# EAGLE design working (EAGLE 9.0.0)
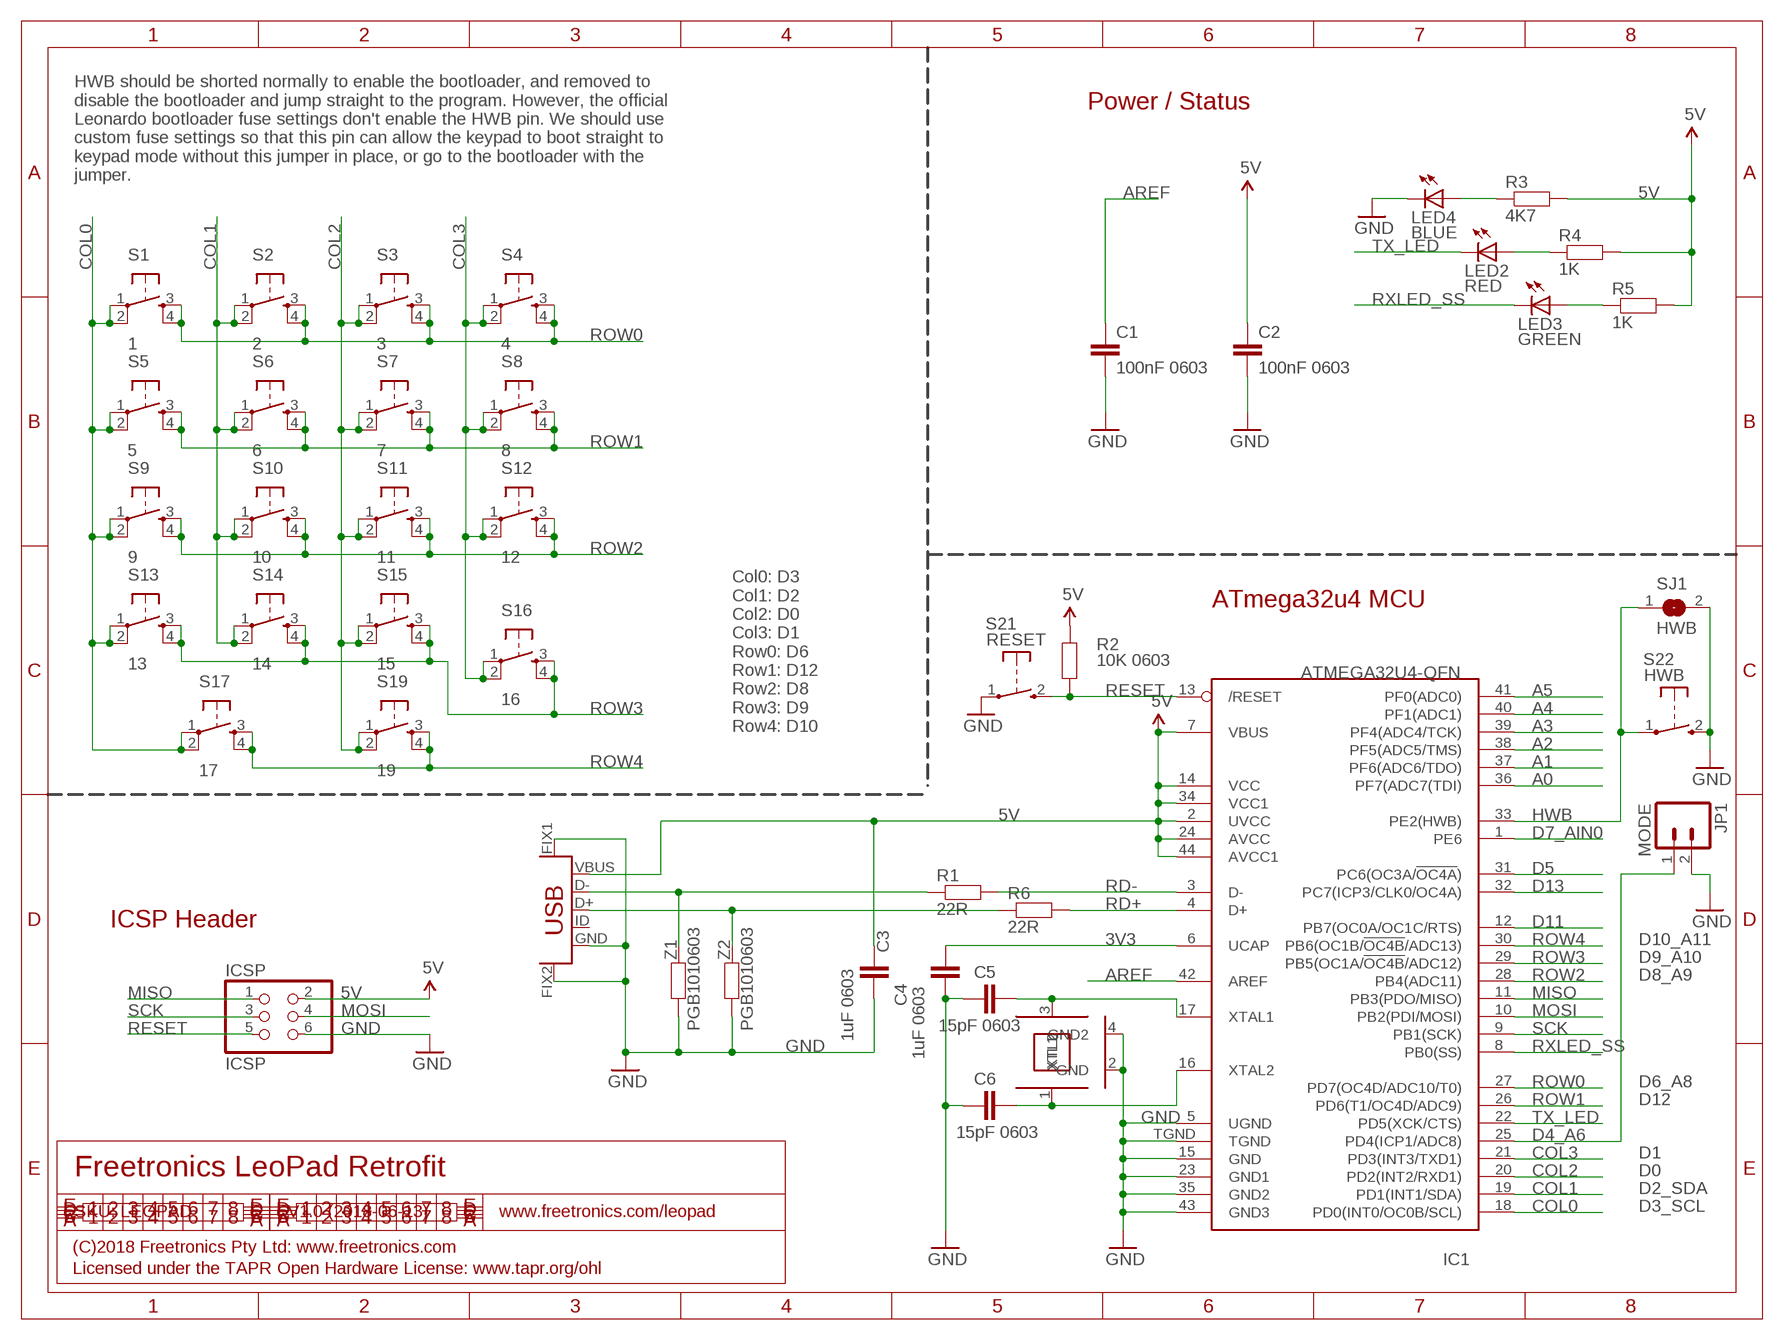
[diagram p0: schematic, sheet 1]

## Parts
C1  100nF 0603  CAP0603  [0603]
C2  100nF 0603  CAP0603  [0603]
C3  1uF 0603  CAP0603  [0603]
C4  1uF 0603  CAP0603  [0603]
C5  15pF 0603  CAP0603  [0603]
C6  15pF 0603  CAP0603  [0603]
IC1  ATMEGA32U4-QFN  [QFN-44N]
ICSP  ICSP  PINHD-2X3  [2X03]
JP1  MODE  M02PTH  [1X02]
LED2  RED  LED0603  [LED-0603]
LED3  GREEN  LED0603  [LED-0603]
LED4  BLUE  LED3MM  [LED3MM]
R1  22R  RESISTOR0603  [0603]
R2  10K 0603  RESISTOR0603  [0603]
R3  4K7  RESISTOR0603  [0603]
R4  1K  RESISTOR0603  [0603]
R5  1K  RESISTOR0603  [0603]
R6  22R  RESISTOR0603  [0603]
S1  1  TAC_SWITCHSMD  [TACTILE_SWITCH_SMD]
S2  2  TAC_SWITCHSMD  [TACTILE_SWITCH_SMD]
S3  3  TAC_SWITCHSMD  [TACTILE_SWITCH_SMD]
S4  4  TAC_SWITCHSMD  [TACTILE_SWITCH_SMD]
S5  5  TAC_SWITCHSMD  [TACTILE_SWITCH_SMD]
S6  6  TAC_SWITCHSMD  [TACTILE_SWITCH_SMD]
S7  7  TAC_SWITCHSMD  [TACTILE_SWITCH_SMD]
S8  8  TAC_SWITCHSMD  [TACTILE_SWITCH_SMD]
S9  9  TAC_SWITCHSMD  [TACTILE_SWITCH_SMD]
S10  10  TAC_SWITCHSMD  [TACTILE_SWITCH_SMD]
S11  11  TAC_SWITCHSMD  [TACTILE_SWITCH_SMD]
S12  12  TAC_SWITCHSMD  [TACTILE_SWITCH_SMD]
S13  13  TAC_SWITCHSMD  [TACTILE_SWITCH_SMD]
S14  14  TAC_SWITCHSMD  [TACTILE_SWITCH_SMD]
S15  15  TAC_SWITCHSMD  [TACTILE_SWITCH_SMD]
S16  16  TAC_SWITCHSMD  [TACTILE_SWITCH_SMD]
S17  17  TAC_SWITCHSMD  [TACTILE_SWITCH_SMD]
S19  19  TAC_SWITCHSMD  [TACTILE_SWITCH_SMD]
S21  RESET  TAC_SWITCH_2PINSMT  [TACTILE_SWITCH_SMD_2PIN_TINY]
S22  HWB  TAC_SWITCH_2PINSMT  [TACTILE_SWITCH_SMD_2PIN_TINY]
SJ1  HWB  SJN  [SJ]
U$2  USB-2P2P  [USB-MICROB-MB05PMXX]
XTL1  16MHz  CRYSTAL-GND3X2  [CRYSTAL-SMD-3X2]
Z1  PGB1010603  RESISTOR0603  [0603]
Z2  PGB1010603  RESISTOR0603  [0603]

## Nets
3V3: C4.2 IC1.6(UCAP)
5V: C2.1 C3.1 IC1.2(UVCC) IC1.7(VBUS) IC1.14(VCC) IC1.24(AVCC) IC1.34(VCC1) IC1.44(AVCC1) ICSP.2 R2.2 R3.2 R4.2 R5.2 U$2.VBUS
A0: IC1.36(PF7(ADC7(TDI))
A1: IC1.37(PF6(ADC6/TDO))
A2: IC1.38(PF5(ADC5/TMS))
A3: IC1.39(PF4(ADC4/TCK))
A4: IC1.40(PF1(ADC1))
A5: IC1.41(PF0(ADC0))
AREF: C1.1 IC1.42(AREF)
COL0: IC1.18(PD0(INT0/OC0B/SCL)) S1.1 S1.2 S5.1 S5.2 S9.1 S9.2 S13.1 S13.2 S17.1 S17.2
COL1: IC1.19(PD1(INT1/SDA)) S2.1 S2.2 S6.1 S6.2 S10.1 S10.2 S14.1 S14.2
COL2: IC1.20(PD2(INT2/RXD1)) S3.1 S3.2 S7.1 S7.2 S11.1 S11.2 S15.1 S15.2 S19.1 S19.2
COL3: IC1.21(PD3(INT3/TXD1)) S4.1 S4.2 S8.1 S8.2 S12.1 S12.2 S16.1 S16.2
D4_A6: IC1.25(PD4(ICP1/ADC8)) JP1.1
D5: IC1.31(PC6(OC3A/!OC4A!))
D7_AIN0: IC1.1(PE6)
D11: IC1.12(PB7(OC0A/OC1C/RTS))
D13: IC1.32(PC7(ICP3/CLK0/OC4A))
D+: R6.1 U$2.D+ Z2.2
D-: R1.1 U$2.D- Z1.2
GND: C1.2 C2.2 C3.2 C4.1 C5.1 C6.1 IC1.5(UGND) IC1.15(GND) IC1.23(GND1) IC1.35(GND2) IC1.43(GND3) IC1.TGND ICSP.6 JP1.2 LED4.K(C) S21.1(P) S22.2(S) SJ1.2 U$2.FIX1(TAB1) U$2.FIX2(TAB2) U$2.GND XTL1.2(GND) XTL1.4(GND2) Z1.1 Z2.1
HWB: IC1.33(PE2(HWB)) S22.1(P) SJ1.1
MISO: IC1.11(PB3(PDO/MISO)) ICSP.1
MOSI: IC1.10(PB2(PDI/MOSI)) ICSP.4
N$6: LED4.A R3.1
N$7: LED2.A R4.1
N$8: LED3.A R5.1
N$11: C5.2 IC1.17(XTAL1) XTL1.3(XTL2)
N$12: C6.2 IC1.16(XTAL2) XTL1.1(XTL1)
RD+: IC1.4(D+) R6.2
RD-: IC1.3(D-) R1.2
RESET: IC1.13(/RESET) ICSP.5 R2.1 S21.2(S)
ROW0: IC1.27(PD7(OC4D/ADC10/T0)) S1.3 S1.4 S2.3 S2.4 S3.3 S3.4 S4.3 S4.4
ROW1: IC1.26(PD6(T1/OC4D/ADC9)) S5.3 S5.4 S6.3 S6.4 S7.3 S7.4 S8.3 S8.4
ROW2: IC1.28(PB4(ADC11)) S9.3 S9.4 S10.3 S10.4 S11.3 S11.4 S12.3 S12.4
ROW3: IC1.29(PB5(OC1A/!OC4B!/ADC12)) S13.3 S13.4 S14.3 S14.4 S15.3 S15.4 S16.3 S16.4
ROW4: IC1.30(PB6(OC1B/!OC4B!/ADC13)) S17.3 S17.4 S19.3 S19.4
RXLED_SS: IC1.8(PB0(SS)) LED3.C
SCK: IC1.9(PB1(SCK)) ICSP.3
TX_LED: IC1.22(PD5(XCK/CTS)) LED2.C
Unconnected: U$2.ID

## Notes on the sheet
- Power / Status
- HWB should be shorted normally to enable the bootloader, and removed to
  disable the bootloader and jump straight to the program. However, the official
  Leonardo bootloader fuse settings don't enable the HWB pin. We should use
  custom fuse settings so that this pin can allow the keypad to boot straight to
  keypad mode without this jumper in place, or go to the bootloader with the
  jumper.
- ATmega32u4 MCU
- Col0: D3
  Col1: D2
  Col2: D0
  Col3: D1
  Row0: D6
  Row1: D12
  Row2: D8
  Row3: D9
  Row4: D10
- ICSP Header
- D10_A11
- D9_A10
- D8_A9
- D6_A8
- D12
- D1
- Freetronics LeoPad Retrofit | D0
- D2_SDA
- D3_SCL
- SKU: LEOPAD | V1.0 (2018-06-13) | www.freetronics.com/leopad
- (C)2018 Freetronics Pty Ltd: www.freetronics.com
- Licensed under the TAPR Open Hardware License: www.tapr.org/ohl

## Library data of the parts
C1-C6 = freetronics-master-v1.1:CAP: Capacitor Standard 0603 ceramic capacitor, and 0.1" leaded capacitor.
IC1 = freetronics-jon:ATMEGA32U4: ATMEGA32U4
ICSP = pinhead:PINHD-2X3: PIN HEADER
JP1 = freetronics-jon:M02: Header 2 Standard 2-pin 0.1" header. Use with straight break away headers (SKU : PRT-00116), right angle break away headers (PRT-00553), swiss pins (PRT-00743), machine pins (PRT-00117), and female headers (PRT-00115). Molex polarized connector foot print use with SKU : PRT-08233 with associated crimp pins and housings.
LED2-LED4 = freetronics-jon:LED: LEDs Standard schematic elements and footprints for 5mm, 3mm, 1206, and 0603 sized LEDs. 5mm - Spark Fun Electronics SKU : COM-00529 (and others)
R1 R3-R6 = freetronics-jon:RESISTOR: Resistor Basic schematic elements and footprints for 0603, 1206, and PTH 1/10th watt (small) resistors.
R2 Z1 Z2 = freetronics-master-v1.1:RESISTOR: Resistor Basic schematic elements and footprints for 0603, 1206, and PTH 1/10th watt (small) resistors.
S1-S17 S19 = freetronics-original:TAC_SWITCH: Momentary Switch Button commonly used for reset or general input. Spark Fun Electronics SKU : COM-00097
S21 S22 = freetronics-jon:TAC_SWITCH_2PIN: Momentary Tactile Switch - 2 pin
SJ1 = freetronics-jon:SJ: SMD solder JUMPER
U$2 = freetronics-jon:USB-2P
XTL1 = freetronics-jon:CRYSTAL-GND

## Net classes
0 default: width 0.152 mm, drill 0.241 mm, clearance 0.152 mm

## Board
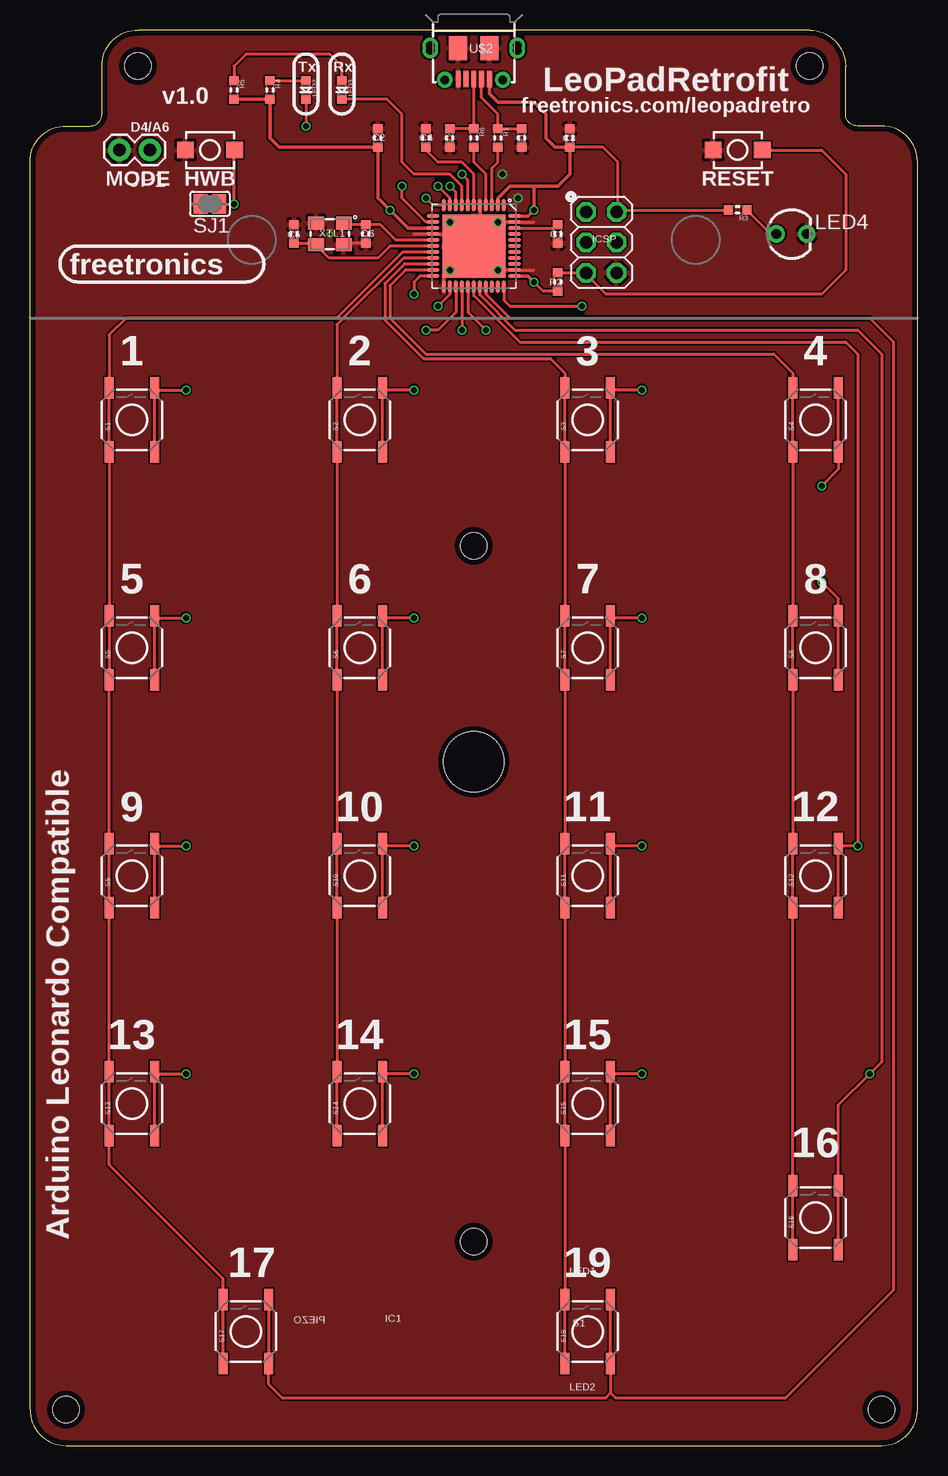
[diagram p1: board, top side]
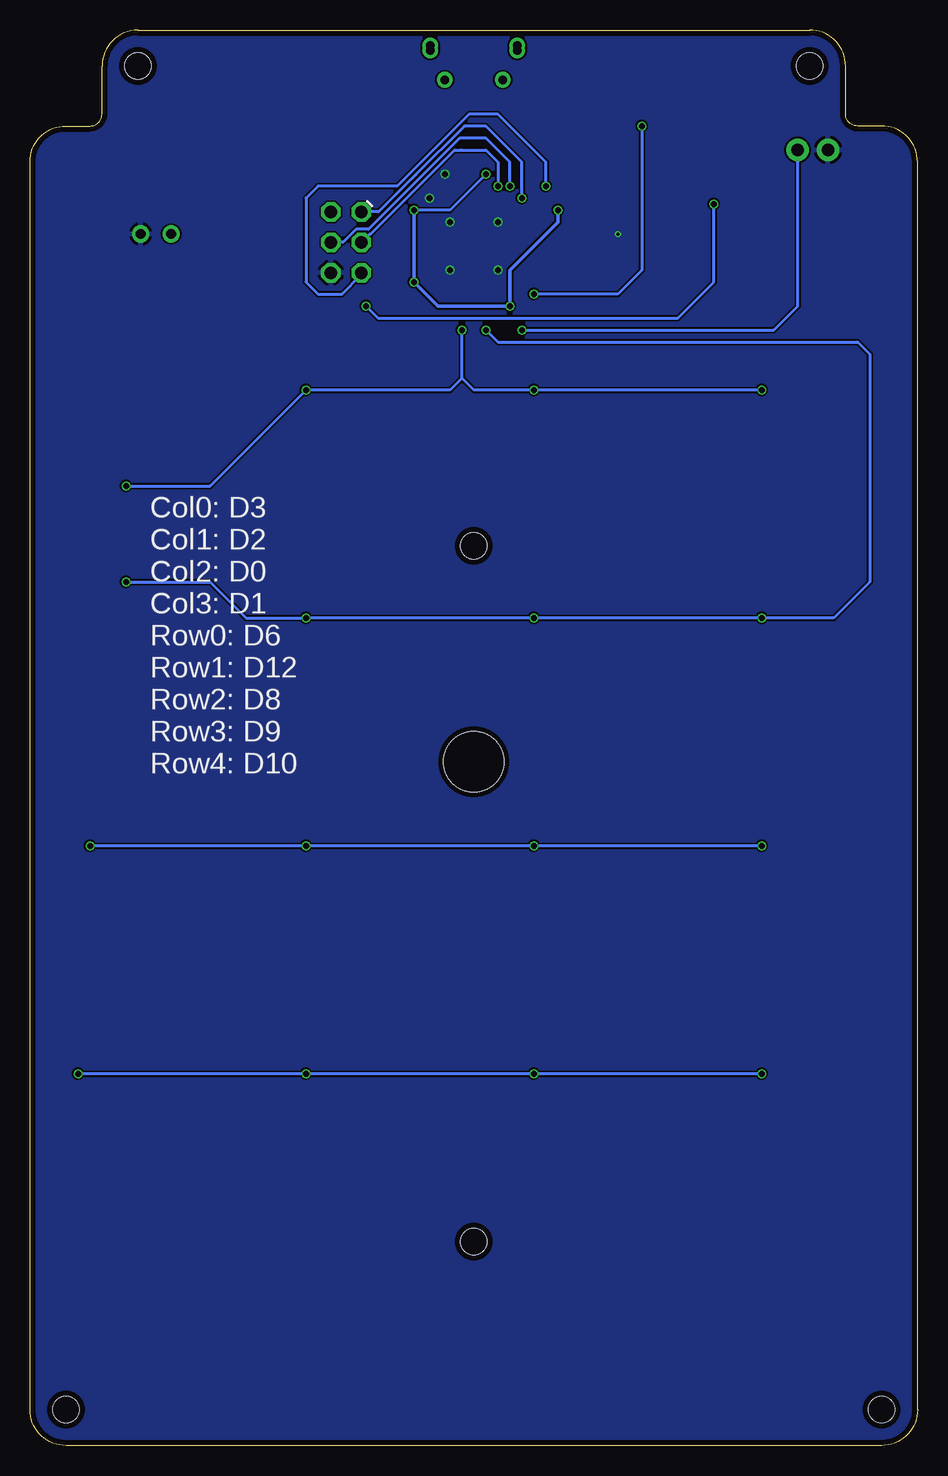
[diagram p2: board, bottom side, seen from below]

Size 74 x 118 mm. Coordinates in mm from the lower left corner, seen from the top.
Outline: 3,0 71,0 arc90 74,3 74,107 arc90 71,110 69,110 arc-90 68,111 68,115 arc90 65,118 9,118 arc90 6,115 6,111 arc-90 5,110 3,110 arc90 0,107 0,3 arc90 3,0
Copper layers (1*16): Top 0.035mm / dielectric 1.5mm / Bottom 0.035mm
Design rules "default *": minimum track width 6mil, minimum drill 9.5mil, track to track 6mil, track to pad 6mil, pad to pad 6mil, via to via 6mil, smd to smd 6mil, copper to edge 18mil, drill to drill 8mil, minimum pad ring 12mil, minimum via ring 4mil, stop-mask expansion 2mil, vias tented up to drill 25mil, thermal gap 10mil
Holes 2.2 mm at 37,75 37,17 9,115 65,115 3,3 71,3
Holes 5 mm at 37,57

### Footprints (pad centres in the part's own frame; a part is rotated, then mirrored left to right if it is on the bottom)
0603 = smd 0.762 x 0.762: 1 -0.762,0; 2 0.762,0
QFN-44N = smd 0.3 x 1.05: 1 -2.5,-3.4; 2 -2,-3.4; 3 -1.5,-3.4; 4 -1,-3.4; 5 -0.5,-3.4; 6 0,-3.4; 7 0.5,-3.4; 8 1,-3.4; 9 1.5,-3.4; 10 2,-3.4; 11 2.5,-3.4; 23 2.5,3.4; 24 2,3.4; 25 1.5,3.4; 26 1,3.4; 27 0.5,3.4; 28 0,3.4; 29 -0.5,3.4; 30 -1,3.4; 31 -1.5,3.4; 32 -2,3.4; 33 -2.5,3.4 | smd 1.05 x 0.3: 12 3.4,-2.5; 13 3.4,-2; 14 3.4,-1.5; 15 3.4,-1; 16 3.4,-0.5; 17 3.4,0; 18 3.4,0.5; 19 3.4,1; 20 3.4,1.5; 21 3.4,2; 22 3.4,2.5; 34 -3.4,2.5; 35 -3.4,2; 36 -3.4,1.5; 37 -3.4,1; 38 -3.4,0.5; 39 -3.4,0; 40 -3.4,-0.5; 41 -3.4,-1; 42 -3.4,-1.5; 43 -3.4,-2; 44 -3.4,-2.5 | smd 5.25 x 5.25: TGND 0,0
2X03 = drill 1.016 octagon: 1 -2.54,-1.27; 2 -2.54,1.27; 3 0,-1.27; 4 0,1.27; 5 2.54,-1.27; 6 2.54,1.27
1X02 = drill 1.016 pad 1.88: 1 0,0; 2 2.54,0
LED-0603 = smd 0.762 x 0.762: A -0.762,0; C 0.762,0
LED3MM = drill 0.813: A -1.27,0; K 1.27,0
TACTILE_SWITCH_SMD = smd 1.778 x 0.762: 1 -2.667,1.905; 2 2.667,1.905; 3 -2.667,-1.905; 4 2.667,-1.905
TACTILE_SWITCH_SMD_2PIN_TINY = smd 1.4 x 1.4: 1 -2.05,0; 2 2.05,0
SJ = smd 1.168 x 1.6: 1 -0.762,0; 2 0.762,0
USB-MICROB-MB05PMXX = smd 0.4 x 1.35: D+ 0,2.575; D- -0.65,2.575; GND 1.3,2.575; ID 0.65,2.575; VBUS -1.3,2.575 | smd 1.5 x 2: FIX1 -1.3,0; FIX2 1.3,0 | drill 0.7: PIN1 -2.425,2.65; PIN2 2.425,2.65; SLOT1 -3.625,-0.2; SLOT2 3.625,-0.2; TAB1 -3.625,0.2; TAB2 3.625,0.2
CRYSTAL-SMD-3X2 = smd 1.3 x 1.1: 1 -1.15,-0.9; 2 1.15,-0.9; 3 1.15,0.9; 4 -1.15,0.9

### Placement (x,y rotation side)
C1  44,101 270 top
C2  29,109 90 top
C3  45,109 90 top
C4  33,109 270 top
C5  22,101 270 top
C6  28,101 90 top
IC1  37,100 180 top
ICSP  47.64,100.3 270 top
JP1  10,108 180 top
LED2  23,113 270 top
LED3  26,113 270 top
LED4  63.5,101 0 top
R1  39,109 270 top
R2  44,97 270 top
R3  59,103 180 top
R4  20,113 270 top
R5  17,113 270 top
R6  37,109 270 top
S1  8.5,85.5 90 top
S2  27.5,85.5 90 top
S3  46.5,85.5 90 top
S4  65.5,85.5 90 top
S5  8.5,66.5 90 top
S6  27.5,66.5 90 top
S7  46.5,66.5 90 top
S8  65.5,66.5 90 top
S9  8.5,47.5 90 top
S10  27.5,47.5 90 top
S11  46.5,47.5 90 top
S12  65.5,47.5 90 top
S13  8.5,28.5 90 top
S14  27.5,28.5 90 top
S15  46.5,28.5 90 top
S16  65.5,19 90 top
S17  18,9.5 90 top
S19  46.5,9.5 90 top
S21  59,108 0 top
S22  15,108 180 top
SJ1  15,103.5 180 top
U$2  37,116.5 180 top
XTL1  25,101 180 top
Z1  41,109 90 top
Z2  35,109 90 top

### Tracks (layer width: path | path; a pad name or v marks a point on that pad's centre or on a via)
3V3
  Top 0.254: IC1.6 37,106 36,107 34,107 33,108 C4.2
5V  (via drill 0.5)
  Top 0.254: IC1.7 36.5,105.5 v36,106 | R3.2 58.16,102.93 49,102.93 49,107 47.76,108.24 C3.1 44.76,108 | R2.2 42.76,96.24 v42,97 | IC1.24 35,96 v34,95
  Top 0.305: R5.2 R4.2 20,109 20.76,108.24 C2.1 29,104 v30,103 31.5,101.5 IC1.14 | 48.95,102.88 ICSP.2 49,102.93 | IC1.34 41.5,97.5 v42,97 | IC1.44 41.5,102.5 v42,103 42,105 | IC1.2 39,104 40,105 42,105 | U$2.VBUS 38.3,112.7 39,112 42,112 43,111 43,109 43.76,108.24 C3.1 45,106 44,105 42,105
  Bottom 0.254: v36,106 39,103 v42,103
  Bottom 0.305: v42,103 v42,97 40,95 v34,95 34,98 30,102 v30,103
AREF
  Top 0.254: IC1.42 43.74,101.5 C1.1
COL0
  Top 0.254: IC1.18 31.07,99.5 25.57,94 8,94 6.59,92.59 S1.2 S1.1 S5.2 S5.1 S9.2 S9.1 S13.2 S13.1 6.59,23.41 16.09,13.9 S17.2 S17.1
COL1
  Top 0.254: IC1.19 31.15,99 26.07,93.92 26,93.85 25.59,93.45 S2.2 S2.1 S6.2 S6.1 S10.2 S10.1 S14.2 S14.1
COL2
  Top 0.254: IC1.20 31.22,98.5 29.59,96.87 29.59,93.83 32.83,90.59 43.41,90.59 44.59,89.41 S3.2 S3.1 S7.2 S7.1 S11.2 S11.1 S15.2 S15.1 S19.2 S19.1
COL3
  Top 0.254: IC1.21 31.3,98 30,96.7 30,94 33,91 62,91 63.59,89.41 S4.2 S4.1 S8.2 S8.1 S12.2 S12.1 S16.2 S16.1
D4_A6  (via drill 0.5)
  Top 0.254: IC1.25 35.5,94.5 34,93 v33,93
  Bottom 0.254: v33,93 12,93 10,95 JP1.1
D+
  Top 0.254: Z2.2 R6.1 U$2.D+
D-
  Top 0.254: Z1.2 R1.1 39,111 37.65,112.35 U$2.D-
GND  (via drill 0.25 pad 0.5, 0.5)
  Top 0.254: IC1.TGND v39,98 IC1.35 42,98 | IC1.5 37.5,102 | 37.5,102 37.5,100.5 IC1.TGND | IC1.TGND 36,101 IC1.15 32,101 | 37.5,102 v39,102 IC1.43 42,102 | IC1.23 34.5,98.5 36,100 IC1.TGND | C6.1 26.29,100.24 XTL1.4
  other vias: 25,101 35,102 35,98 40.7,104 39.4,106
  pour Bottom: 6,115 arc-74 9,118 65,118 arc-74 68,115 68,111 arc90 69,110 71,110 arc-90 74,107 74,3 arc-74 71,0 3,0 arc-74 0,3 0,107 arc-90 3,110 5,110 arc90 6,111
  pour Top: 6,115 arc-74 9,118 65,118 arc-74 68,115 68,111 arc90 69,110 71,110 arc-90 74,107 74,3 arc-74 71,0 3,0 arc-74 0,3 0,107 arc-90 3,110 5,110 arc90 6,111
HWB  (via drill 0.5)
  Top 0.254: IC1.33 39.5,95.5 40,95 v46,95 | S22.1 17,107.95 v17,103.5 SJ1.1
  Bottom 0.254: v46,95 45,94 20,94 17,97 v17,103.5
MISO  (via drill 0.5)
  Top 0.254: IC1.11 33.6,103.4 v33,104
  Bottom 0.254: v33,104 33,107 36,110 37.78,110 41.89,105.89 42.1,105.68 44.95,102.84 ICSP.1
MOSI  (via drill 0.5)
  Top 0.254: IC1.10 35,104 v34,105
  Bottom 0.203: 49.09,100.3 ICSP.4
  Bottom 0.254: v34,105 34,107 36,109 38.17,109 45.79,101.39 46.82,101.39 47.91,100.3 ICSP.4
N$6
  Top 0.254: R3.1 61.76,101 LED4.A
N$7
  Top 0.254: R4.1 LED2.A
N$8
  Top 0.254: LED3.A 26,115 25,116 18,116 17,115 R5.1
N$11
  Top 0.254: IC1.17 30,100 29,99 24.95,99 XTL1.3 23.71,100.24 C5.2
N$12
  Top 0.254: 26.11,101.72 XTL1.1 26.29,101.76 C6.2 29.24,101.76 30.5,100.5 IC1.16
RD+
  Top 0.254: IC1.4 38,106 37,107 R6.2
RD-
  Top 0.254: IC1.3 38.5,106.5 39,107 R1.2
RESET  (via drill 0.5)
  Top 0.254: S21.2 66,108 68,106 68,98 66,96 48,96 46.37,97.63 | 46.37,97.63 ICSP.5 | IC1.13 33,102 31,104 v31,105 | R2.1 46.24,97.76 46.37,97.63
  Bottom 0.254: v31,105 31,107 35,111 37.39,111 43.39,105 50,105 51,104 51,97 50,96 48,96 46.37,97.63 ICSP.5
ROW0  (via drill 0.5)
  Top 0.254: IC1.27 36.5,94.5 v38,93 | S2.3 29.41,88 | 29.41,88 S2.4 | S3.3 48.41,88 | 48.41,88 S3.4 | S1.3 S1.4 10.57,88 v13,88 | S4.4 S4.3 67.41,81.41 v66,80 | v32,88 29.41,88 | v51,88 48.41,88
  Bottom 0.254: 38,89 v38,93 | v13,88 v32,88 37,88 38,89 | 38,89 39,88 v51,88 59,80 v66,80
ROW1  (via drill 0.5)
  Top 0.254: IC1.26 v36,93 | S5.3 S5.4 10.57,69 v13,69 | S6.3 29.41,69 | 29.41,69 S6.4 | S7.3 48.41,69 | 48.41,69 S7.4 | S8.3 S8.4 67.41,70.59 v66,72 | v51,69 48.41,69 | v32,69 29.41,69
  Bottom 0.254: v36,93 35,92 5,92 4,91 4,72 7,69 v13,69 v32,69 v51,69 56,69 59,72 v66,72
ROW2  (via drill 0.5)
  Top 0.254: IC1.28 37,95.85 40.85,92 68,92 69,91 v69,50 67.41,50 | S12.3 67.41,50 | 67.41,50 S12.4 | S10.3 29.41,50 | 29.41,50 S10.4 | S11.3 48.41,50 | 48.41,50 S11.4 | S9.3 S9.4 10.57,50 v13,50 | v32,50 29.41,50 | v51,50 48.41,50
  Bottom 0.254: v13,50 v32,50 v51,50 v69,50
ROW3  (via drill 0.5)
  Top 0.254: IC1.29 37.5,95.92 40.42,93 69,93 71,91 71,32 v70,31 67.41,28.41 S16.4 S16.3 | S15.3 48.41,31 | 48.41,31 S15.4 | S14.3 29.41,31 | 29.41,31 S14.4 | S13.3 S13.4 10.57,31 v13,31 | v32,31 29.41,31 | v51,31 48.41,31
  Bottom 0.254: v13,31 v32,31 v51,31 v70,31
ROW4
  Top 0.254: IC1.30 38,96 40,94 70,94 72,92 72,13 63,4 48.81,4 48.41,4.41 | S19.4 S19.3 48.41,4.41 | 48.41,4.41 48,4 21,4 19.91,5.09 S17.3 S17.4
RXLED_SS
  Top 0.254: IC1.8 36,105 35,106 32,106 31,107 31,111 29.76,112.24 LED3.C
SCK  (via drill 0.5)
  Top 0.254: IC1.9 35.5,104.5 v35,105
  Bottom 0.254: v35,105 35,107 36,108 38,108 38.13,108 38.6,108 45.62,100.98 45.68,100.98 ICSP.3
TX_LED  (via drill 0.5)
  Top 0.254: LED2.C v23,110 | IC1.22 32.5,97.5 32,97 v32,96
  Bottom 0.254: v23,110 23,98 25,96 v32,96

### Text on the board
tPlace: Tx | Rx | LeoPadRetrofit | v1.0 | freetronics.com/leopadretro | D4/A6 | MODE | HWB | RESET | freetronics | 1 | 2 | 3 | 4 | 5 | 6 | 7 | 8 | 9 | 10 | 11 | 12 | 13 | 14 | 15 | 16 | Arduino Leonardo Compatible | 17 | 19
bPlace: Col0: D3 / Col1: D2 / Col2: D0 / Col3: D1 / Row0: D6 / Row1: D12 / Row2: D8 / Row3: D9 / Row4: D10
tNames: LED1 | PIEZO | IC1 | S1 | LED2